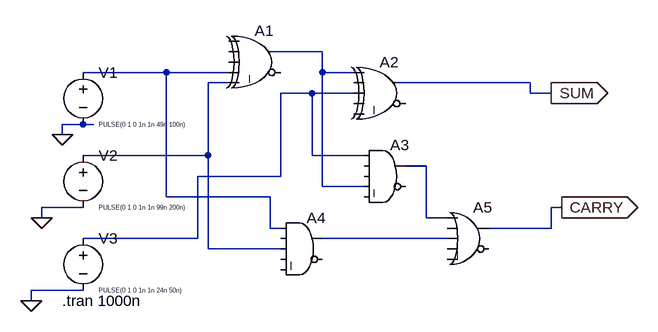
[diagram p0: schematic full adder.asc]
full adder.asc, the LTspice schematic file:
Version 4
SHEET 1 880 680
WIRE 256 80 176 80
WIRE 16 112 -112 112
WIRE 112 112 16 112
WIRE 256 112 256 80
WIRE 304 112 256 112
WIRE 112 128 80 128
WIRE 576 128 368 128
WIRE 240 144 192 144
WIRE 304 144 240 144
WIRE 576 144 576 128
WIRE 608 144 576 144
WIRE -112 192 -144 192
WIRE -96 192 -112 192
WIRE -144 208 -144 192
WIRE 80 240 80 128
WIRE 80 240 -112 240
WIRE 240 240 240 144
WIRE 320 240 240 240
WIRE 416 256 384 256
WIRE 192 272 192 144
WIRE 192 272 64 272
WIRE 256 288 256 112
WIRE 320 288 256 288
WIRE 16 304 16 112
WIRE 176 304 16 304
WIRE -112 320 -176 320
WIRE 624 320 608 320
WIRE -176 336 -176 320
WIRE 416 336 416 256
WIRE 448 336 416 336
WIRE 176 352 176 304
WIRE 192 352 176 352
WIRE 608 352 608 320
WIRE 608 352 512 352
WIRE 64 368 64 272
WIRE 64 368 -112 368
WIRE 448 368 256 368
WIRE 80 384 80 240
WIRE 192 384 80 384
WIRE -112 448 -192 448
WIRE -192 464 -192 448
FLAG 608 144 SUM
IOPIN 608 144 Out
FLAG 624 320 CARRY
IOPIN 624 320 Out
FLAG -144 208 0
FLAG -176 336 0
FLAG -192 464 0
SYMBOL Digital\\xor 160 32 R0
SYMATTR InstName A1
SYMBOL Digital\\xor 352 80 R0
SYMATTR InstName A2
SYMBOL Digital\\and 352 208 R0
SYMATTR InstName A3
SYMBOL Digital\\and 224 320 R0
SYMATTR InstName A4
SYMBOL Digital\\or 480 304 R0
SYMATTR InstName A5
SYMBOL voltage -112 96 R0
WINDOW 3 24 96 Left 0
WINDOW 123 0 0 Left 0
WINDOW 39 0 0 Left 0
SYMATTR Value PULSE(0 1 0 1n 1n 49n 100n)
SYMATTR InstName V1
SYMBOL voltage -112 224 R0
WINDOW 3 24 96 Left 0
WINDOW 123 0 0 Left 0
WINDOW 39 0 0 Left 0
SYMATTR Value PULSE(0 1 0 1n 1n 99n 200n)
SYMATTR InstName V2
SYMBOL voltage -112 352 R0
WINDOW 3 24 96 Left 0
WINDOW 123 0 0 Left 0
WINDOW 39 0 0 Left 0
SYMATTR Value PULSE(0 1 0 1n 1n 24n 50n)
SYMATTR InstName V3
TEXT -144 464 Left 2 !.tran 1000n

The netlist it stands for:
* full adder.asc
A1 0 0 0 N002 N003 0 N001 0 XOR
A2 N001 0 N004 0 0 0 SUM 0 XOR
A3 N004 0 0 N001 0 0 N005 0 AND
A4 N002 0 N003 0 0 0 N006 0 AND
A5 N005 0 N006 0 0 0 CARRY 0 OR
V1 N002 0 PULSE(0 1 0 1n 1n 49n 100n)
V2 N003 0 PULSE(0 1 0 1n 1n 99n 200n)
V3 N004 0 PULSE(0 1 0 1n 1n 24n 50n)
.tran 1000n
.backanno
.end